# Altium schematic sheet LATCH_SN74ALS573.SchDoc
size A4
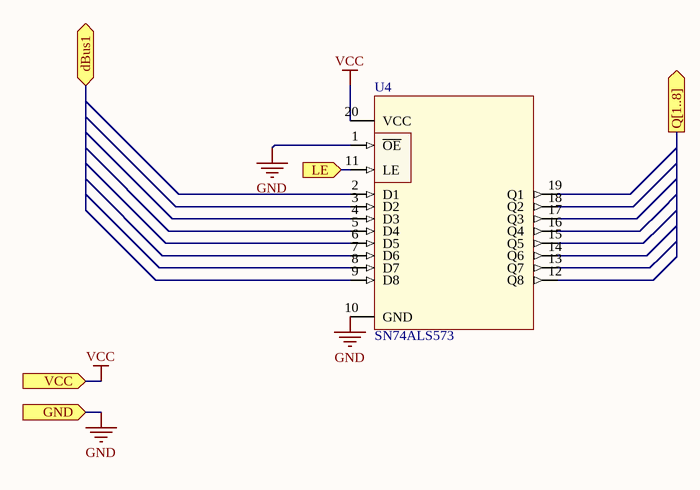
[diagram p0: LATCH_SN74ALS573.SchDoc]

## Parts
U4  SN74ALS573  [PLASTIC_DIP20]

## Ports
dBus1 (bidir), GND (in), LE (in), Q[1..8] (out), VCC (in)

## Nets
GND: U4.1(~{OE}) U4.10(GND) ; port GND
VCC: U4.20(VCC) ; port VCC
LE: U4.11(LE) ; port LE

Not connected (* = marked no-connect by the designer): U4 2(D1) 3(D2) 4(D3) 5(D4) 6(D5) 7(D6) 8(D7) 9(D8) 12(Q8) 13(Q7) 14(Q6) 15(Q5) 16(Q4) 17(Q3) 18(Q2) 19(Q1)

## Library data of the parts
U4 = 4154: id: 4154; rad: 11; rom: GM; lager_type: Baklager; dybde: 9; hylle: 750; antall: 60; kolonne: 0; pakke_opprettet_av: 1154; symbol_opprettet_av: 1855; navn: SN74HC573AN; pris: 5; nokkelord: 74, sn74; pakke_opprettet: 11.10.2016 16:46:43; symbol_opprettet: 26.09.2018 10:49:10